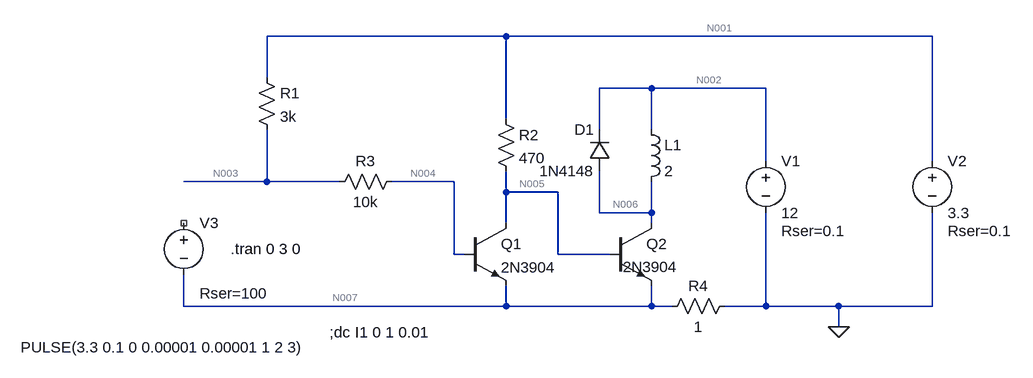
[diagram p0: schematic Incubator Relay.asc]
Incubator Relay.asc, the LTspice schematic file:
Version 4
SHEET 1 940 680
WIRE 144 -128 -224 -128
WIRE 800 -128 144 -128
WIRE -224 -64 -224 -128
WIRE 368 -48 288 -48
WIRE 544 -48 368 -48
WIRE 144 0 144 -128
WIRE 288 16 288 -48
WIRE 368 16 368 -48
WIRE 544 64 544 -48
WIRE 800 64 800 -128
WIRE -224 96 -224 16
WIRE -224 96 -352 96
WIRE -112 96 -224 96
WIRE 64 96 -32 96
WIRE 144 112 144 80
WIRE 224 112 144 112
WIRE 288 144 288 80
WIRE 368 144 368 96
WIRE 368 144 288 144
WIRE 144 160 144 112
WIRE 368 160 368 144
WIRE 64 208 64 96
WIRE 80 208 64 208
WIRE 224 208 224 112
WIRE 304 208 224 208
WIRE -352 288 -352 240
WIRE 144 288 144 256
WIRE 144 288 -352 288
WIRE 368 288 368 256
WIRE 368 288 144 288
WIRE 400 288 368 288
WIRE 544 288 544 144
WIRE 544 288 480 288
WIRE 656 288 544 288
WIRE 800 288 800 144
WIRE 800 288 656 288
WIRE 656 320 656 288
FLAG 656 320 0
SYMBOL npn 80 160 R0
SYMATTR InstName Q1
SYMATTR Value 2N3904
SYMBOL npn 304 160 R0
WINDOW 3 20 67 Left 2
SYMATTR Value 2N3904
SYMATTR InstName Q2
SYMBOL res 128 -16 R0
SYMATTR InstName R2
SYMATTR Value 470
SYMBOL ind 352 0 R0
SYMATTR InstName L1
SYMATTR Value 2
SYMATTR SpiceLine Ipk=2 Rser=600
SYMBOL voltage 544 48 R0
WINDOW 123 0 0 Left 2
WINDOW 39 24 124 Left 2
SYMATTR SpiceLine Rser=0.1
SYMATTR InstName V1
SYMATTR Value 12
SYMBOL diode 304 80 R180
WINDOW 0 24 64 Left 2
WINDOW 3 24 0 Left 2
SYMATTR InstName D1
SYMATTR Value 1N4148
SYMBOL voltage 800 48 R0
WINDOW 123 0 0 Left 2
WINDOW 39 24 124 Left 2
SYMATTR SpiceLine Rser=0.1
SYMATTR InstName V2
SYMATTR Value 3.3
SYMBOL res -240 -80 R0
SYMATTR InstName R1
SYMATTR Value 3k
SYMBOL voltage -352 144 R0
WINDOW 3 -251 207 Left 2
WINDOW 123 0 0 Left 2
WINDOW 39 24 124 Left 2
SYMATTR Value PULSE(3.3 0.1 0 0.00001 0.00001 1 2 3)
SYMATTR SpiceLine Rser=100
SYMATTR InstName V3
SYMBOL res -16 80 R90
WINDOW 0 0 56 VBottom 2
WINDOW 3 32 56 VTop 2
SYMATTR InstName R3
SYMATTR Value 10k
SYMBOL res 496 272 R90
WINDOW 0 0 56 VBottom 2
WINDOW 3 32 56 VTop 2
SYMATTR InstName R4
SYMATTR Value 1
TEXT -128 328 Left 2 !;dc I1 0 1 0.01
TEXT -280 200 Left 2 !.tran 0 3 0

The netlist it stands for:
* Incubator Relay.asc
Q1 N005 N004 N007 0 2N3904
Q2 N006 N005 N007 0 2N3904
R2 N001 N005 470
L1 N002 N006 2 Ipk=2 Rser=600
V1 N002 0 12 Rser=0.1
D1 N006 N002 1N4148
V2 N001 0 3.3 Rser=0.1
R1 N001 N003 3k
V3 NC_01 N007 PULSE(3.3 0.1 0 0.00001 0.00001 1 2 3) Rser=100
R3 N004 N003 10k
R4 0 N007 1
.model D D
.lib standard.dio
.model NPN NPN
.model PNP PNP
.lib standard.bjt
;dc I1 0 1 0.01
.tran 0 3 0
.backanno
.end

* Results of the author's LTspice run, read from the files saved beside the schematic
* Operating Point, zero values left out:
*   V(n005) = 71.62 mV
*   V(n004) = 720.4 mV
*   V(n007) = 7.066 mV
*   V(n006) = 12 V
*   V(n001) = 3.299 V
*   V(n002) = 12 V
*   V(n003) = 2.704 V
*   Ic(Q2) = 12.08 pA
*   Ib(Q2) = -11.87 pA
*   Ic(Q1) = 6.867 mA
*   Ib(Q1) = 198.4 µA
*   Ie(Q1) = -7.066 mA
*   I(L1) = 12.1 pA
*   I(R4) = -7.066 mA
*   I(R3) = -198.4 µA
*   I(R1) = 198.4 µA
*   I(R2) = 6.867 mA
*   I(V2) = -7.066 mA
*   I(V1) = -12.09 pA
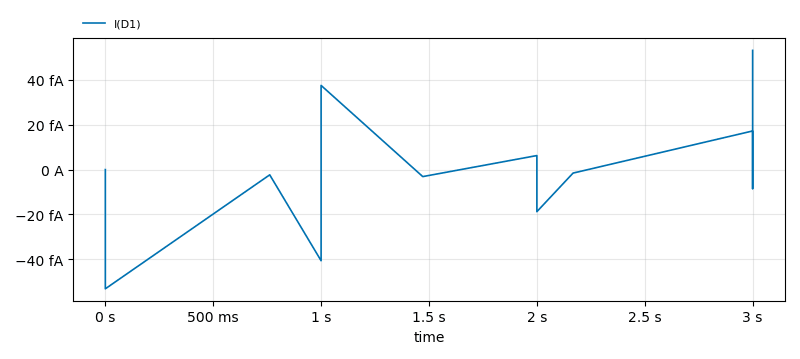
[diagram p1: Transient Analysis of Incubator Relay.asc, plotted from the saved traces]
* Transient Analysis, 1 run:
*   I(D1): min -53.17 fA, max 53.17 fA, average -4.175 fA, rms 24.34 fA, last 53.17 fA